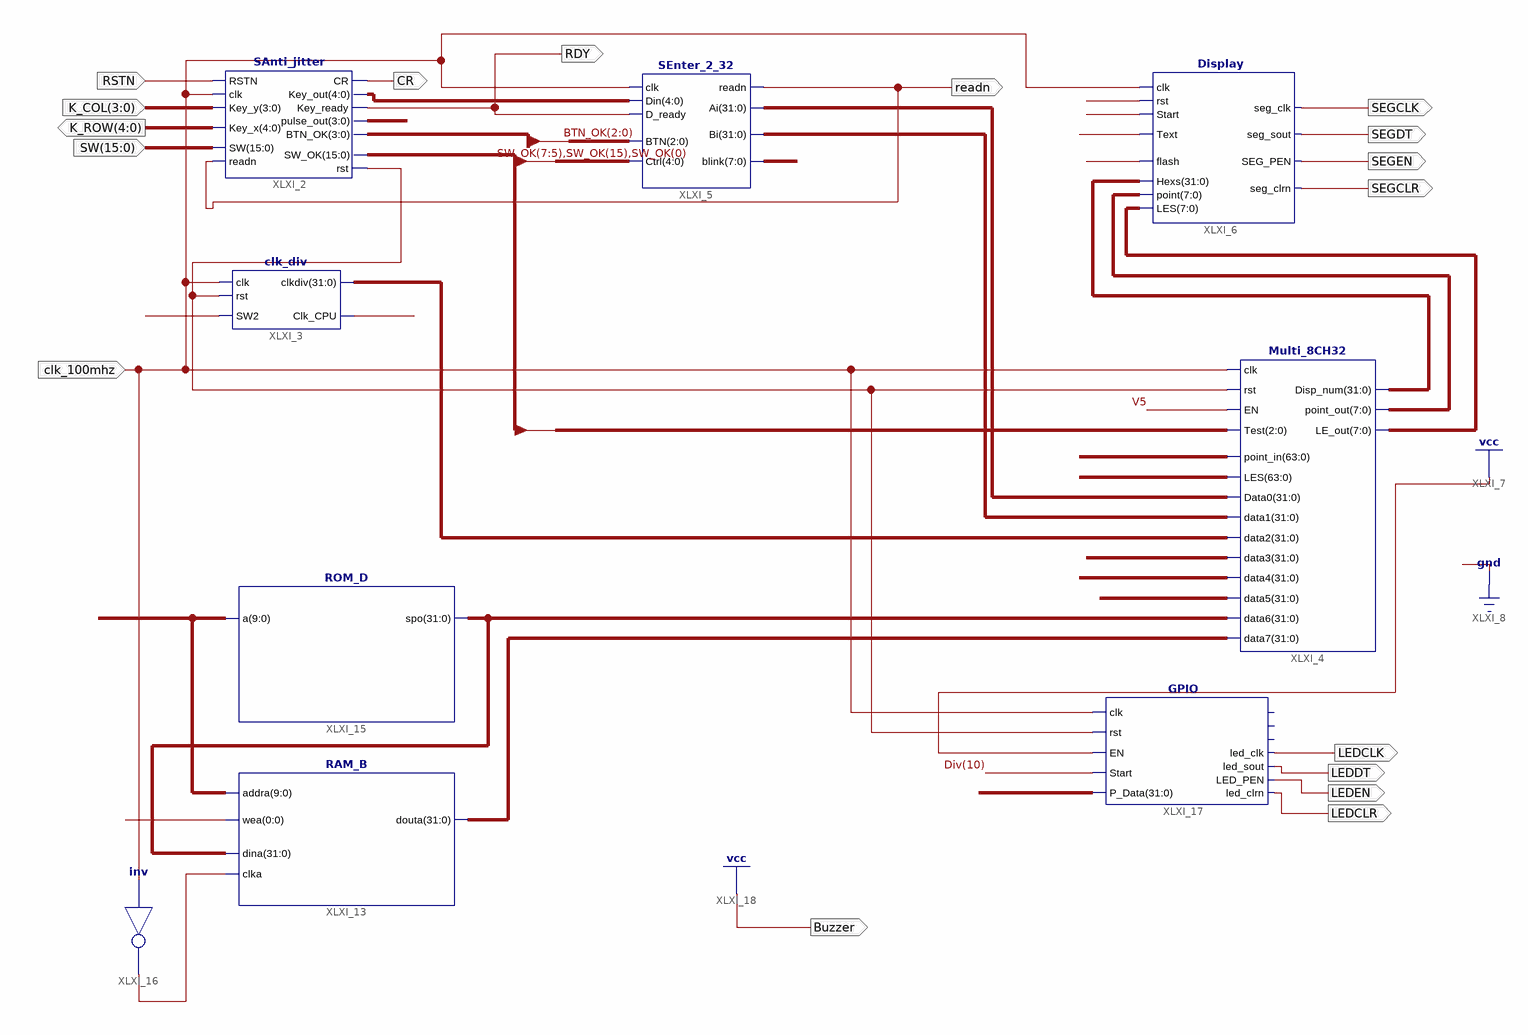
[diagram p0: schematic sheet 1]
// Xilinx ISE schematic Framework.sch (kintex7) as structural Verilog: 9 symbols, 17 ports
module Framework (
  input  RSTN,
  input  [3:0] K_COL,
  input  [15:0] SW,
  input  clk_100mhz,
  output [4:0] K_ROW,
  output CR,
  output RDY,
  output readn,
  output SEGCLK,
  output SEGDT,
  output SEGEN,
  output SEGCLR,
  output LEDCLK,
  output LEDDT,
  output LEDEN,
  output LEDCLR,
  output Buzzer
);

  wire Clk_CPU, rst, XLXN_69, XLXN_72;
  wire [3:0] BTN_OK, Pulse;
  wire [4:0] XLXN_9;
  wire [7:0] blink, LE_out, point_out;
  wire [15:0] SW_OK;
  wire [31:0] Ai, Bi, Disp_num, Div, XLXN_58, XLXN_59, XLXN_60, XLXN_61, XLXN_63, XLXN_75;

  SAnti_jitter XLXI_2 (
    .SW(SW), .readn(readn), .Key_y(K_COL), .Key_x(K_ROW), .RSTN(RSTN), .clk(clk_100mhz), .Key_out(XLXN_9),
    .Key_ready(RDY), .CR(CR), .rst(XLXN_72), .SW_OK(SW_OK), .pulse_out(Pulse), .BTN_OK(BTN_OK));
  clk_div XLXI_3 (.rst(XLXN_72), .clk(clk_100mhz), .SW2(SW_OK[2]), .clkdiv(Div), .Clk_CPU(Clk_CPU));
  Multi_8CH32 XLXI_4 (
    .Test(SW_OK[7:5]), .point_in({Div, Div}), .EN(1'b1), .clk(clk_100mhz), .rst(XLXN_72),
    .LES({{12{1'b0}}, blink[3:0], {32{1'b0}}, blink, blink}), .Data0(Ai), .data1(Bi), .data2(Div),
    .data3(XLXN_58), .data4(XLXN_59), .data5(XLXN_60), .data6(XLXN_61), .data7(XLXN_63),
    .point_out(point_out), .LE_out(LE_out), .Disp_num(Disp_num));
  SEnter_2_32 XLXI_5 (
    .readn(readn), .Ai(Ai), .Bi(Bi), .blink(blink), .Din(XLXN_9), .D_ready(RDY), .clk(clk_100mhz),
    .Ctrl({SW_OK[7:5], SW_OK[15], SW_OK[0]}), .BTN(BTN_OK[2:0]));
  Display XLXI_6 (
    .LES(LE_out), .SEG_PEN(SEGEN), .seg_sout(SEGDT), .seg_clrn(SEGCLR), .point(point_out), .Hexs(Disp_num),
    .Text(SW_OK[0]), .flash(Div[25]), .seg_clk(SEGCLK), .clk(clk_100mhz), .rst(rst), .Start(Div[10]));
  RAM_B XLXI_13 (
    .addra({{5{1'b0}}, SW[3], Div[27:24]}), .clka(XLXN_69), .wea(SW_OK[4]), .dina(XLXN_61), .douta(XLXN_63));
  ROM_D XLXI_15 (.a({{5{1'b0}}, SW[3], Div[27:24]}), .spo(XLXN_61));
  not XLXI_16 (XLXN_69, clk_100mhz);
  GPIO XLXI_17 (
    .clk(clk_100mhz), .P_Data(XLXN_75), .rst(XLXN_72), .EN(1'b1), .Start(Div[10]), .led_clk(LEDCLK),
    .led_clrn(LEDCLR), .LED_PEN(LEDEN), .led_sout(LEDDT));  // open: GPIOf0, LED_out, counter_set

  assign Buzzer = 1'b1;
endmodule
